# EAGLE design Esquematico (EAGLE 9.6.2)
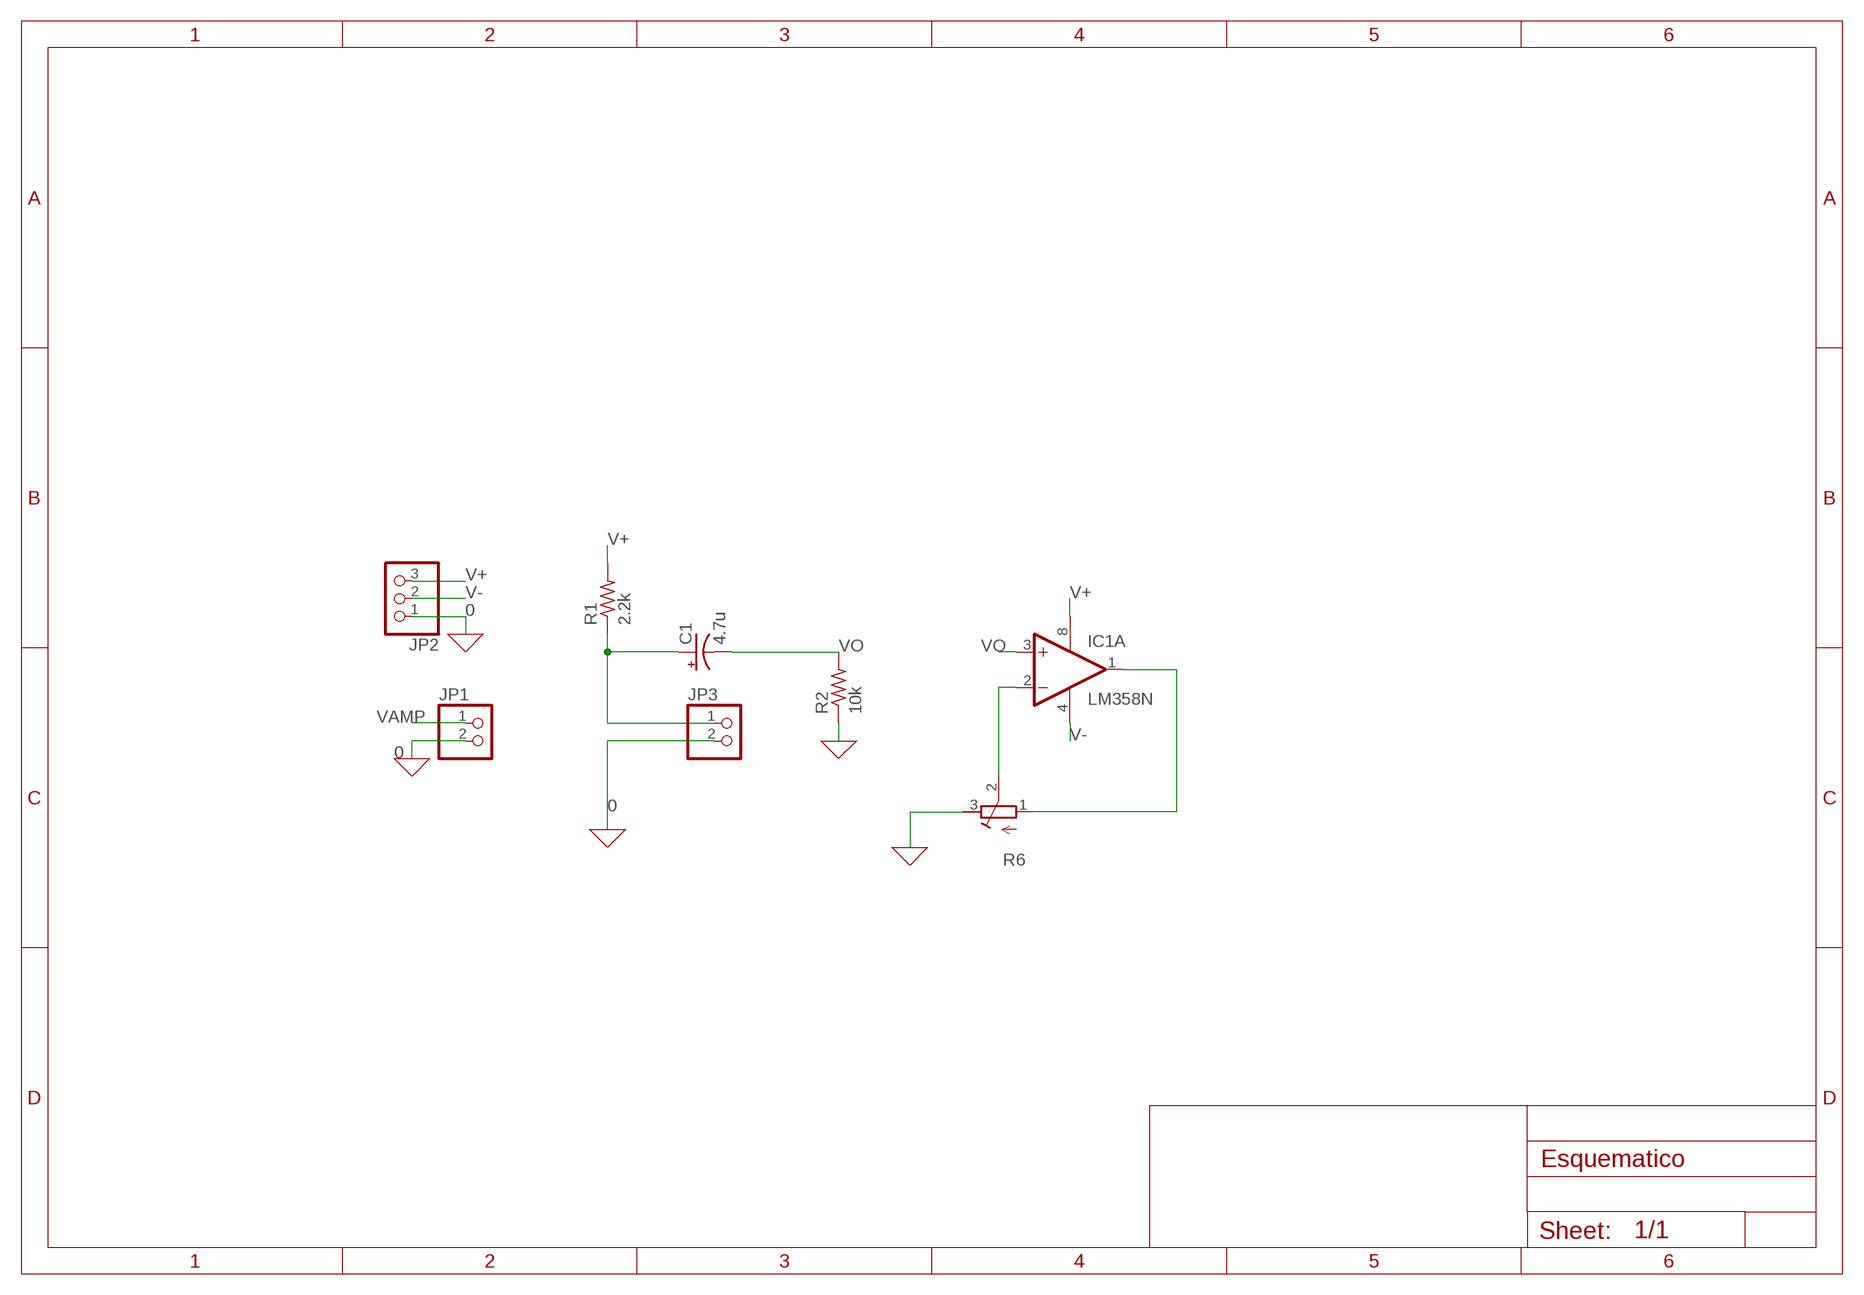
[diagram p0: schematic, sheet 1]

## Parts
C1  4.7u  CPOL-USE3.5-8  [E3,5-8]
IC1  LM358N  [DIL08]
JP1  PINHD-1X2  [1X02]
JP2  PINHD-1X3  [1X03]
JP3  PINHD-1X2  [1X02]
R1  2.2k  R-US_0207/10  [0207/10]
R2  10k  R-US_0207/10  [0207/10]
R6  R-TRIMM64W  [RTRIM64W]

## Nets
0: JP1.2 JP2.1 JP3.2 R2.1 R6.3(E) ; supply symbol labelled GND
N$1: C1.+ JP3.1 R1.1
N$2: IC1.2(A:-IN) R6.2(S)
V+: IC1.8(P:V+) JP2.3 R1.2
V-: IC1.4(P:V-) JP2.2
VAMP: IC1.1(A:OUT) JP1.1 R6.1(A)
VO: C1.- IC1.3(A:+IN) R2.2
Unconnected: IC1.5(B:+IN) IC1.6(B:-IN) IC1.7(B:OUT)

## Library data of the parts
C1 = rcl:CPOL-US: POLARIZED CAPACITOR, American symbol; SPICEPREFIX: C
IC1 = linear:LM358: OP AMP also LM158; LM258; LM2904 Source: http://cache.national.com/ds/LM/LM158.pdf
JP1 JP3 = pinhead:PINHD-1X2: PIN HEADER
JP2 = pinhead:PINHD-1X3: PIN HEADER
R1 R2 = rcl:R-US_: RESISTOR, American symbol; SPICEPREFIX: R
R6 = rcl:R-TRIMM: Trimm resistor; SPICEMODEL: X; SPICEPREFIXL: POT

## Board
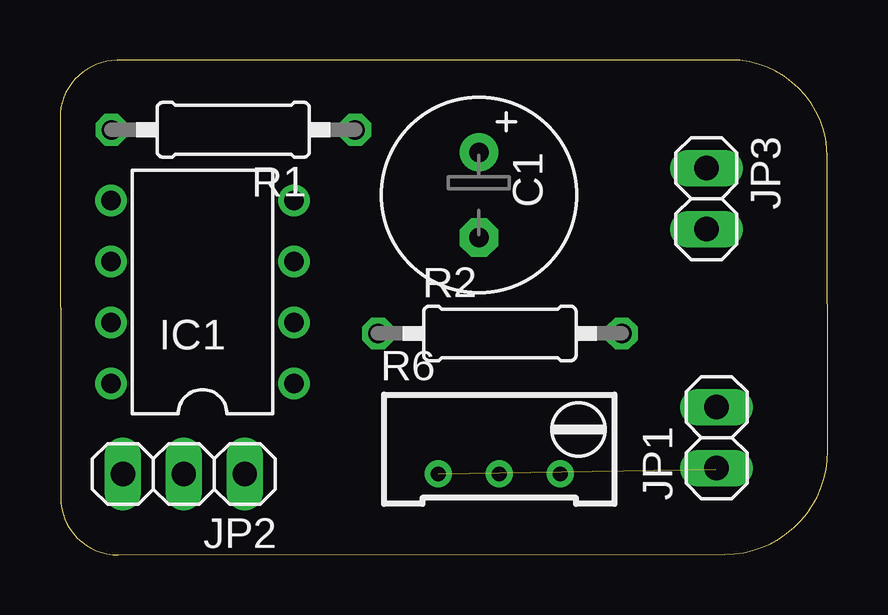
[diagram p1: board, top side]
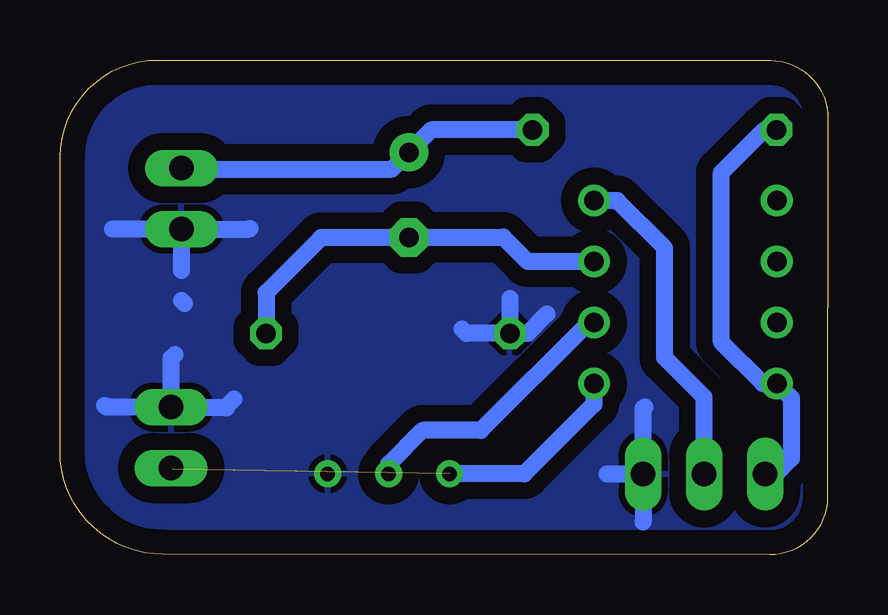
[diagram p2: board, bottom side, seen from below]

Size 31.99 x 20.62 mm. Coordinates in mm from the lower left corner, seen from the top.
Outline: 0,18.21 0.02,2.4 arc90 2.42,0 27.69,0.02 arc90 31.99,4.33 31.98,16.57 arc90 27.92,20.62 2.39,20.6 arc90 0,18.21
Copper layers (1*16): Top 0.035mm / dielectric 1.5mm / Bottom 0.035mm
Design rules "default *": minimum track width 0.7mm, minimum drill 0.35mm, track to track 0.7mm, track to pad 0.7mm, pad to pad 6mil, via to via 6mil, smd to smd 6mil, copper to edge 40mil, drill to drill 6mil, minimum pad ring 10mil, minimum via ring 8mil, stop-mask expansion 4mil, vias tented up to drill 0mil, thermal gap 10mil

### Footprints (pad centres in the part's own frame; a part is rotated, then mirrored left to right if it is on the bottom)
E3,5-8 = drill 0.813 pad 1.6: + -1.778,0 | drill 0.813 pad 1.6 octagon: - 1.778,0
DIL08 = drill 0.813 pad 1.27: 1 -3.81,-3.81; 2 -1.27,-3.81; 3 1.27,-3.81; 4 3.81,-3.81; 5 3.81,3.81; 6 1.27,3.81; 7 -1.27,3.81; 8 -3.81,3.81
1X02 = drill 1.016 long: 1 -1.27,0; 2 1.27,0
1X03 = drill 1.016 long: 1 -2.54,0; 2 0,0; 3 2.54,0
0207/10 = drill 0.813 octagon: 1 -5.08,0; 2 5.08,0
RTRIM64W = drill 0.61: 1 1.27,-2.54; 2 1.27,0; 3 1.27,2.54

### Placement (x,y rotation side)
C1  17.46,15 270 top
IC1  5.94,10.95 90 top
JP1  27.36,4.89 90 top
JP2  5.16,3.37 180 top
JP3  26.93,14.85 270 top
R1  7.22,17.71 180 top
R2  18.33,9.23 0 top
R6  18.3,4.65 270 top

### Tracks (layer width: path | path; a pad name or v marks a point on that pad's centre or on a via)
0
  Bottom 0.7: JP2.1 9.2,3.37 | 26.93,10.61 26.8,10.48 | JP1.2 27.36,8.2 27.21,8.35 | JP2.1 7.7,6.1 7.62,6.17 | JP2.1 7.7,1.38 7.7,1.37 | JP1.2 30.07,6.16 30.14,6.23 | R2.1 15.06,9.23 15.25,9.42 | R2.1 13.24,10.68 | R2.1 12.51,9.23 11.7,10.04 | JP1.2 25.09,6.16 | 25.09,6.16 25.05,6.12 | JP3.2 29.79,13.58 29.8,13.57 | JP3.2 24.1,13.58 24.07,13.61 | JP3.2 26.93,11.85 | 24.75,6.5 25.09,6.16
  pour Bottom: 0.03,18.21 0.03,2.46 arc90 2.49,0 27.48,-0.01 arc90 31.95,4.45 31.95,16.61 arc90 27.98,20.59 2.43,20.6 arc90
N$1
  Bottom 0.7: R1.1 16.52,17.71 C1.+ 18.16,16.07 26.89,16.07 JP3.1
N$2
  Bottom 0.7: R6.2 18.3,3.78 16.9,5.19 14.46,5.19 9.97,9.68 IC1.2
V+
  Bottom 0.7: JP2.3 2.17,3.37 1.52,4.02 1.52,6.54 IC1.8 2.72,7.14 4.44,8.86 4.44,15.93 2.65,17.71 R1.2
V-
  Bottom 0.7: JP2.2 5.16,6.57 6.8,8.22 6.8,12.8 8.77,14.76 IC1.4
VAMP  (1 unrouted)
  Bottom 0.7: 27.32,3.57 JP1.1 | IC1.1 9.75,6.27 12.64,3.38 R6.1
VO
  Bottom 0.7: IC1.3 12.5,12.22 13.52,13.24 17.43,13.24 C1.- 21.11,13.22 23.41,10.92 R2.2